# EAGLE design open-lux-D (EAGLE 6.5.0)
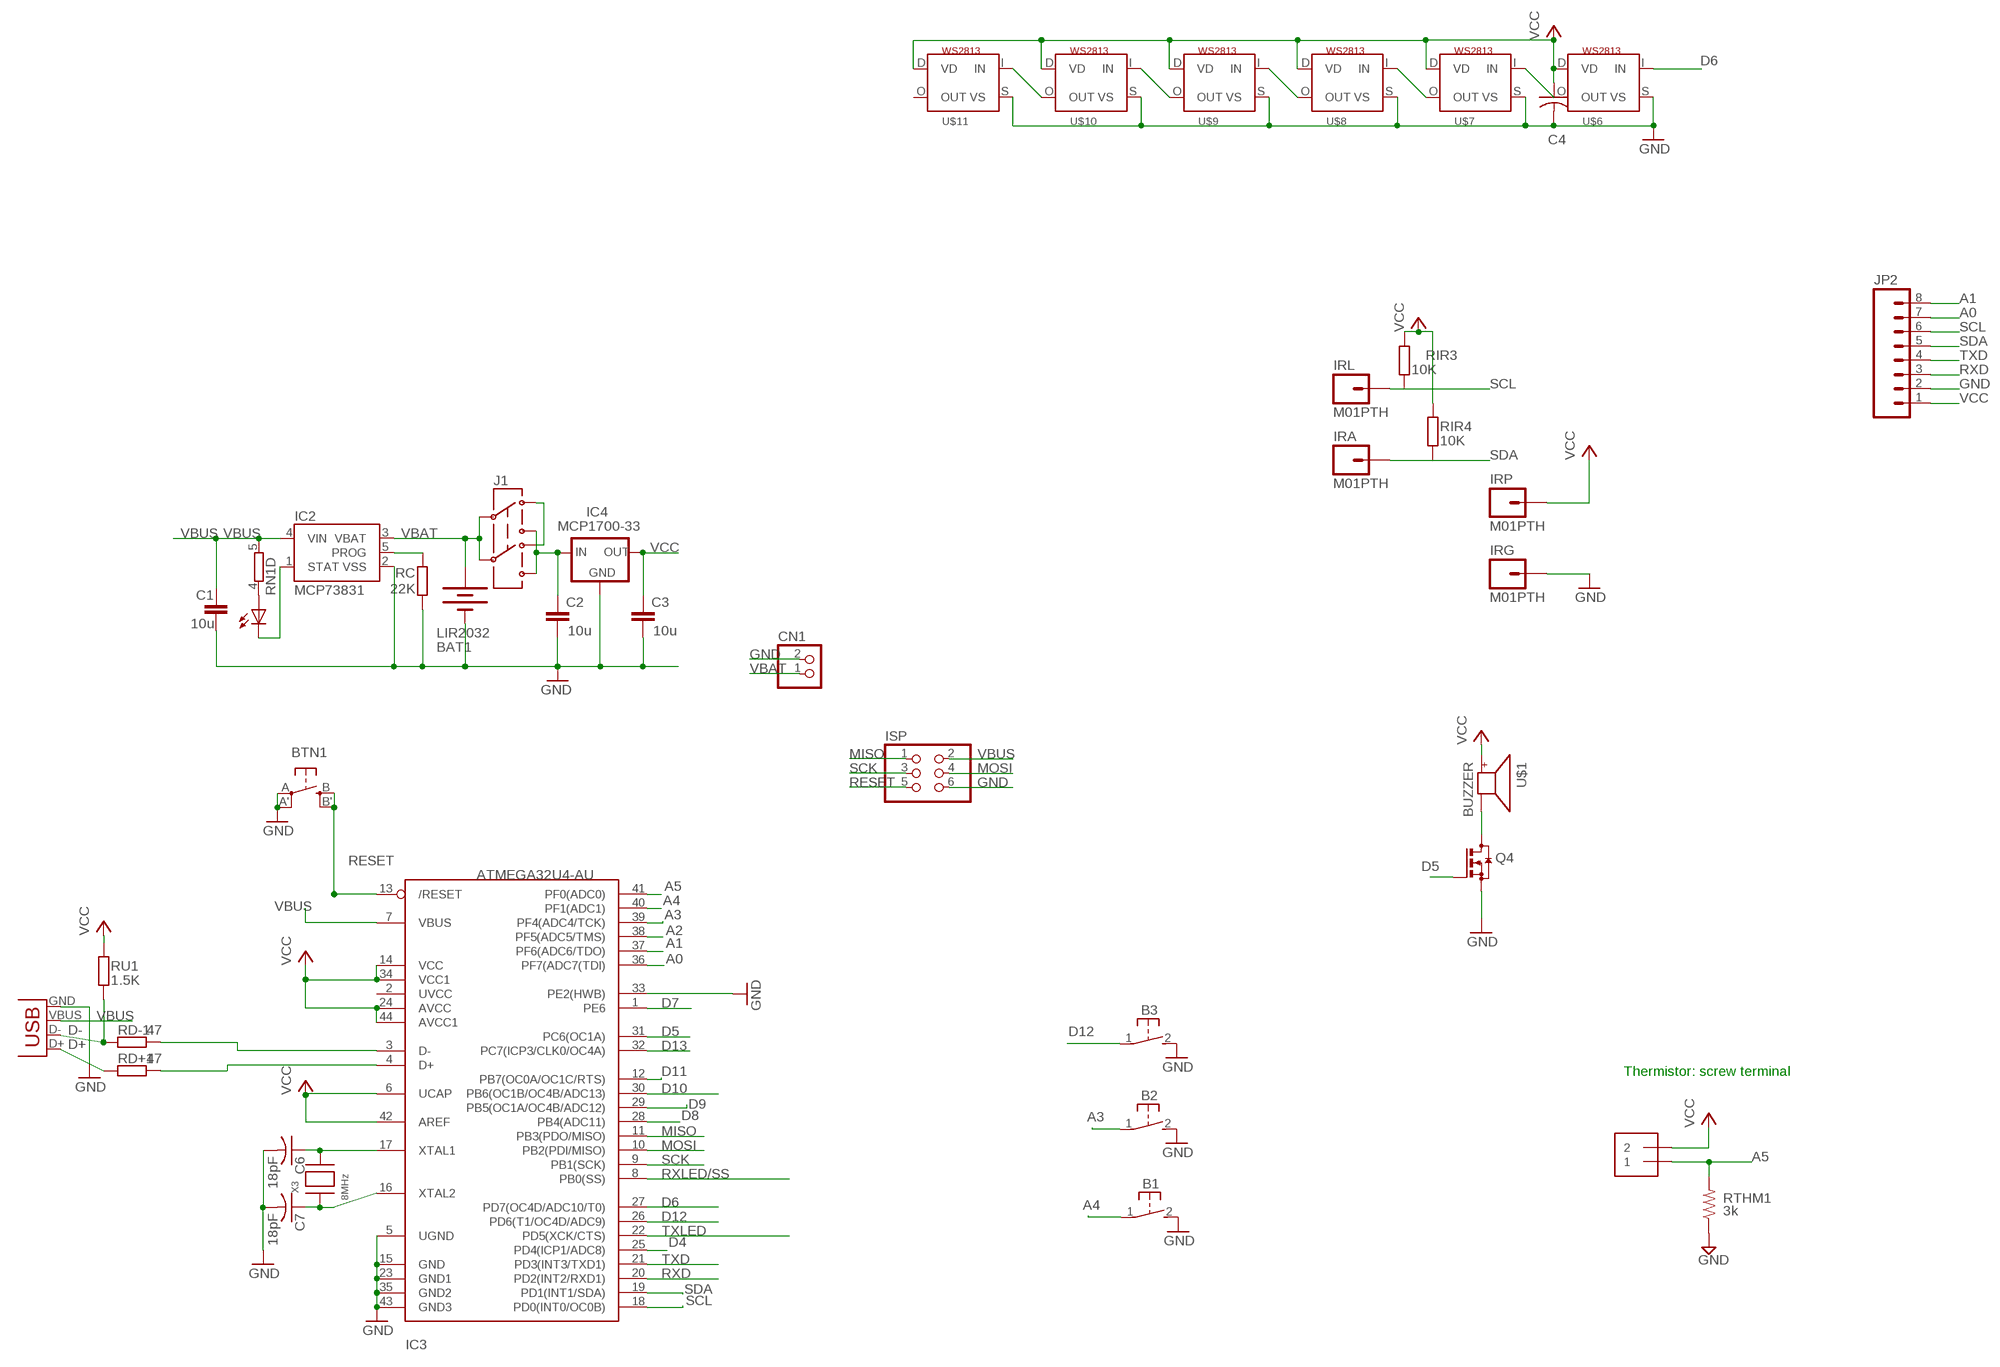
[diagram p0: schematic, sheet 1, part 1 of 2]
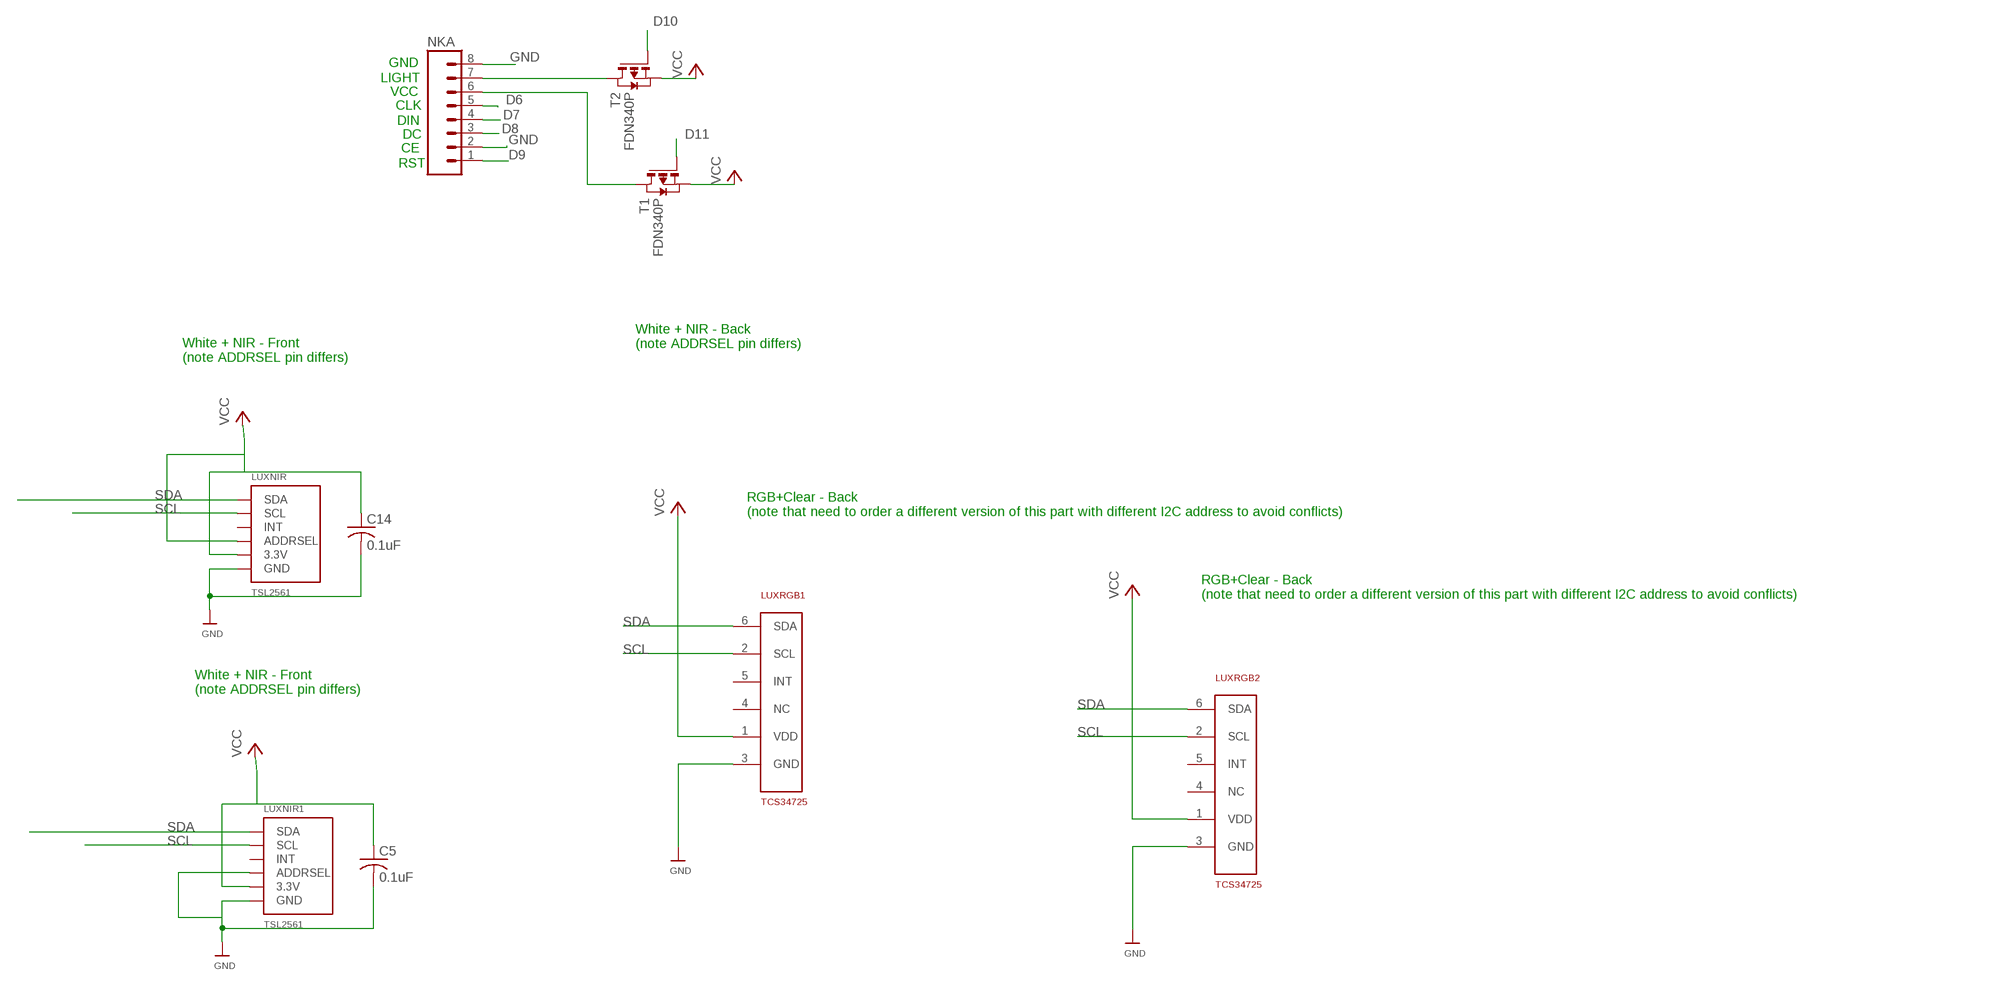
[diagram p1: schematic, sheet 1, part 2 of 2]

## Parts
B1  31-XX  [B3F-31XX]
B2  31-XX  [B3F-31XX]
B3  31-XX  [B3F-31XX]
BAT1  LIR2032  BATTERYBATTCOM_20MM_PTH_SMT  [BATTCOM_20MM_PTH_SMT]
BTN1  EVQQ2  [EVQ-Q2]
C1  10u  C-EUC0805  [C0805]
C2  10u  C-EUC0805  [C0805]
C3  10u  C-EUC0805  [C0805]
C4  C-USC0805K  [C0805K]
C5  0.1uF  C-USC0805  [C0805]
C6  18pF  C-USC0805K  [C0805K]
C7  18pF  C-USC0805K  [C0805K]
C14  0.1uF  C-USC0805  [C0805]
CHG  0805  LEDCHIPLED_0805  [CHIPLED_0805]
CN1  JST_2PIN-SMT-RA  [JST-PH-2-SMT-RA]
IC2  MCP73831  [SOT23-5]
IC3  ATMEGA32U4-AU  [TQFP44]
IC4  MCP1700-33  MCP1700SOT233  [SOT23]
IRA  M01PTH  [1X01]
IRG  M01PTH  [1X01]
IRL  M01PTH  [1X01]
IRP  M01PTH  [1X01]
ISP  PINHD-2X3  [2X03]
J1  AYZ0202  [AYZ0202]
JP2  M08LOCK  [1X08_LOCK]
LUXNIR  TSL2561  [TSL2561_FN@1]
LUXNIR1  TSL2561  [TSL2561_FN@1]
LUXRGB1  TCS34725  [DFN-6]
LUXRGB2  TCS34725  [DFN-6]
NKA  M08LOCK  [1X08_LOCK]
Q4  BSS123  [SOT23]
RC  22K  R-EU_R0805  [R0805]
RD+1  47  R-EU_R0805  [R0805]
RD-1  47  R-EU_R0805  [R0805]
RIR3  10K  R-EU_R0805  [R0805]
RIR4  10K  R-EU_R0805  [R0805]
RN1  4R-NEXB38V  [EXB38V]
RTHM1  3k  R-US_R0805  [R0805@1]
RU1  1.5K  R-EU_R0805  [R0805]
T1  FDN340P  PMOSSOT23  [SOT-23]
T2  FDN340P  PMOSSOT23  [SOT-23]
THM1  1X2-3.5MM  [1X2-3.5MM]
U$1  BUZZER  [SMT-8585-BUZZER]
U$6  WS2813  [RGBLED5050_4]
U$7  WS2813  [RGBLED5050_4]
U$8  WS2813  [RGBLED5050_4]
U$9  WS2813  [RGBLED5050_4]
U$10  WS2813  [RGBLED5050_4]
U$11  WS2813  [RGBLED5050_4]
X2  USBSMD  [USB-MINIB]
X3  8MHz  XTALNX5032  [NX5032]

## Nets
A0: IC3.36(PF7(ADC7(TDI)) JP2.7
A1: IC3.37(PF6(ADC6/TDO)) JP2.8
A2: IC3.38(PF5(ADC5/TMS))
A3: B2.1(P) IC3.39(PF4(ADC4/TCK))
A4: B1.1(P) IC3.40(PF1(ADC1))
A5: IC3.41(PF0(ADC0)) RTHM1.2 THM1.1
D4: IC3.25(PD4(ICP1/ADC8))
D5: IC3.31(PC6(OC1A)) Q4.1(G)
D6: IC3.27(PD7(OC4D/ADC10/T0)) NKA.5 U$6.I(IN)
D7: IC3.1(PE6) NKA.4
D8: IC3.28(PB4(ADC11)) NKA.3
D9: IC3.29(PB5(OC1A/OC4B/ADC12)) NKA.1
D10: IC3.30(PB6(OC1B/OC4B/ADC13)) T2.3(G)
D11: IC3.12(PB7(OC0A/OC1C/RTS)) T1.3(G)
D12: B3.1(P) IC3.26(PD6(T1/OC4D/ADC9))
D13: IC3.32(PC7(ICP3/CLK0/OC4A))
D+: RD+1.1 X2.D+
D-: RD-1.1 RU1.1 X2.D-
GND: B1.2(S) B2.2(S) B3.2(S) BAT1.P$1(-) BTN1.A'(P1) BTN1.A(P) C1.2 C2.2 C3.2 C4.2 C5.2 C6.2 C7.2 C14.2 CN1.2 IC2.2(VSS) IC3.5(UGND) IC3.15(GND) IC3.23(GND1) IC3.33(PE2(HWB)) IC3.35(GND2) IC3.43(GND3) IC4.1(GND) IRG.1 ISP.6 JP2.2 LUXNIR1.ADR(ADDRSEL) LUXNIR1.VSS(GND) LUXNIR.VSS(GND) LUXRGB1.3(GND) LUXRGB2.3(GND) NKA.2 NKA.8 Q4.2(S) RC.1 RTHM1.1 U$6.S(VS) U$7.S(VS) U$8.S(VS) U$9.S(VS) U$10.S(VS) U$11.S(VS) X2.GND
MISO: IC3.11(PB3(PDO/MISO)) ISP.1
MOSI: IC3.10(PB2(PDI/MISO)) ISP.4
N$1: J1.3 J1.6
N$2: C7.1 IC3.16(XTAL2) X3.P$1
N$3: C6.1 IC3.17(XTAL1) X3.P$2
N$4: NKA.7 T2.1(D)
N$5: CHG.C IC2.1(STAT)
N$6: IC2.5(PROG) RC.2
N$7: Q4.3(D) U$1.-
N$8: NKA.6 T1.1(D)
N$10: CHG.A RN1.4
N$21: IC3.4(D+) RD+1.2
N$22: IC3.3(D-) RD-1.2
N$23: U$6.O(OUT) U$7.I(IN)
N$24: U$7.O(OUT) U$8.I(IN)
N$25: U$8.O(OUT) U$9.I(IN)
N$26: U$9.O(OUT) U$10.I(IN)
N$28: U$10.O(OUT) U$11.I(IN)
RESET: BTN1.B'(S1) BTN1.B(S) IC3.13(/RESET) ISP.5
RXD: IC3.20(PD2(INT2/RXD1)) JP2.3
RXLED/SS: IC3.8(PB0(SS))
SCK: IC3.9(PB1(SCK)) ISP.3
SCL: IC3.18(PD0(INT0/OC0B)) IRL.1 JP2.6 LUXNIR1.CLK(SCL) LUXNIR.CLK(SCL) LUXRGB1.2(SCL) LUXRGB2.2(SCL) RIR3.1
SDA: IC3.19(PD1(INT1/SDA)) IRA.1 JP2.5 LUXNIR1.DATA(SDA) LUXNIR.DATA(SDA) LUXRGB1.6(SDA) LUXRGB2.6(SDA) RIR4.1
TXD: IC3.21(PD3(INT3/TXD1)) JP2.4
TXLED: IC3.22(PD5(XCK/CTS))
VBAT: BAT1.P$2(+) CN1.1 IC2.3(VBAT) J1.2 J1.5
VBUS: C1.1 IC2.4(VIN) IC3.7(VBUS) ISP.2 RN1.5 X2.VBUS
VCC: C3.1 C4.1 C5.1 C14.1 IC3.6(UCAP) IC3.14(VCC) IC3.24(AVCC) IC3.34(VCC1) IC3.42(AREF) IC3.44(AVCC1) IC4.2(OUT) IRP.1 JP2.1 LUXNIR1.VDD(3.3V) LUXNIR.ADR(ADDRSEL) LUXNIR.VDD(3.3V) LUXRGB1.1(VDD) LUXRGB2.1(VDD) RIR3.2 RIR4.2 RU1.2 T1.2(S) T2.2(S) THM1.2 U$1.+ U$6.D(VD) U$7.D(VD) U$8.D(VD) U$9.D(VD) U$10.D(VD) U$11.D(VD)
VDD: C2.1 IC4.3(IN) J1.1 J1.4
Unconnected: IC3.2(UVCC) LUXNIR1.INT LUXNIR.INT LUXRGB1.4(NC) LUXRGB1.5(INT) LUXRGB2.4(NC) LUXRGB2.5(INT) RN1.1 RN1.2 RN1.3 RN1.6 RN1.7 RN1.8 U$11.O(OUT)

## Notes on the sheet
- GND
- LIGHT
- VCC
- CLK
- DIN
- DC
- CE
- RST
- White + NIR - Back
  (note ADDRSEL pin differs)
- White + NIR - Front
  (note ADDRSEL pin differs)
- RGB+Clear - Back 
  (note that need to order a different version of this part with different I2C address to avoid conflicts)
- RGB+Clear - Back 
  (note that need to order a different version of this part with different I2C address to avoid conflicts)
- White + NIR - Front
  (note ADDRSEL pin differs)
- Thermistor: screw terminal

## Library data of the parts
B1-B3 = adafruit:31-XX: OMRON SWITCH Now with beefier pads!
BAT1 = SparkFunNew:BATTERY: Battery Holders Various common sizes : AA, AAA, 20mm coin cell and 12mm coin cell.
BTN1 = adafruit:EVQQ2: SMT 6mm switch, EVQQ2 series http://www.ladyada.net/library/eagle
C1-C3 = resistor:C-EU: CAPACITOR, European symbol
C4 = adafruit2013:C-US: CAPACITOR, American symbol
C5-C7 C14 = adafruit:C-US: CAPACITOR, American symbol
CHG = led:LED: LED OSRAM: - CHIPLED LG R971, LG N971, LY N971, LG Q971, LY Q971, LO R971, LY R971 LH N974, LH R974 LS Q976, LO Q976, LY Q976 LO Q996 - Hyper CHIPLED LW Q18S LB Q993, LB Q99A, LB R99A - SideLED LS A670, LO A670, LY A670, LG A670, LP A670 LB A673, LV A673, LT A673, LW A673 LH A674 LY A675 LS A676, LA A676, LO A676, LY A676, LW A676 LS A679, LY A679, LG A679 - Hyper Micro SIDELED® LS Y876, LA Y876, LO Y876, LY Y876 LT Y87S - SmartLED LW L88C, LW L88S LB L89C, LB L89S, LG L890 LS L89K, LO L89K, LY L89K LS L896, LA L896, LO L896, LY L896 - TOPLED LS T670, LO T670, LY T670, LG T670, LP T670 LSG T670, LSP T670, LSY T670, LOP T670, LYG T670 LG T671, LOG T671, LSG T671 LB T673, LV T673, LT T673, LW T673 LH T674 LS T676, LA T676, LO T676, LY T676, LB T676, LH T676, LSB T676, LW T676 LB T67C, LV T67C, LT T67C, LS T67K, LO T67K, LY T67K, LW E67C LS E67B, LA E67B, LO E67B, LY E67B, LB E67C, LV E67C, LT E67C LW T67C LS T679, LY T679, LG T679 LS T770, LO T770, LY T770, LG T770, LP T770 LB T773, LV T773, LT T773, LW T773 LH T774 LS E675, LA E675, LY E675, LS T675 LS T776, LA T776, LO T776, LY T776, LB T776 LHGB T686 LT T68C, LB T68C - Hyper Mini TOPLED® LB M676 - Mini TOPLED Santana® LG M470 LS M47K, LO M47K, LY M47K Source: http://www.osram.convergy.de LUXEON: - LUMILED® LXK2-PW12-R00, LXK2-PW12-S00, LXK2-PW14-U00, LXK2-PW14-V00 LXK2-PM12-R00, LXK2-PM12-S00, LXK2-PM14-U00 LXK2-PE12-Q00, LXK2-PE12-R00, LXK2-PE12-S00, LXK2-PE14-T00, LXK2-PE14-U00 LXK2-PB12-K00, LXK2-PB12-L00, LXK2-PB12-M00, LXK2-PB14-N00, LXK2-PB14-P00, LXK2-PB14-Q00 LXK2-PR12-L00, LXK2-PR12-M00, LXK2-PR14-Q00, LXK2-PR14-R00 LXK2-PD12-Q00, LXK2-PD12-R00, LXK2-PD12-S00 LXK2-PH12-R00, LXK2-PH12-S00 LXK2-PL12-P00, LXK2-PL12-Q00, LXK2-PL12-R00 Source: www.luxeon.com KINGBRIGHT: KA-3528ASYC Source: www.kingbright.com
CN1 = adafruit:JST_2PIN: JST 2-Pin Connectors of various flavors SMT-RA (S2B-PH-SM4) 4UConnector #17311 SMT (B2B-PH-SM4) THM-RA (S2B-PH) THM (B2B-PH)
IC2 = SparkFunNew:MCP73831: Microchip's MCP73831 Miniature single cell, fully integrated Li-Ion, Li-polymer charge management controller http://ww1.microchip.com/downloads/en/DeviceDoc/21984a.pdf
IC3 = adaprog:ATMEGA32U4
IC4 = adafruit:MCP1700: VOLTAGE REGULATOR
IRA IRG IRL IRP = SparkFun-Connectors:M01: Header 1 Standard 1-pin 0.1" header. Use with straight break away headers (SKU : PRT-00116), right angle break away headers (PRT-00553), swiss pins (PRT-00743), machine pins (PRT-00117), and female headers (PRT-00115).
ISP = pinhead:PINHD-2X3: PIN HEADER
J1 = SparkFunNew:AYZ0202: SPDT Slide Switch Simple SMD single-pull double-throw slide switch. Good for less than 350mA power switch, switching UARTs between devices, etc. Spark Fun Electronics SKU : COM-00597
JP2 NKA = SparkFun-Connectors:M08: Header 8 Standard 8-pin 0.1" header. Use with straight break away headers (SKU : PRT-00116), right angle break away headers (PRT-00553), swiss pins (PRT-00743), machine pins (PRT-00117), and female headers (PRT-00115).
LUXNIR LUXNIR1 = microbuilder:TSL2561: TSL2561 Light-To-Digital Sensor Mouser Part Numbers: CS (obsolete): 856-TSL2561CS DFN (cheapest): 856-TSL2561FN
LUXRGB1 LUXRGB2 = dwbLibrary:TCS34725
Q4 = transistor-small-signal:BSS123: N-CHANNEL MOS FET
RC RD+1 RD-1 RIR3 RIR4 RU1 = rcl:R-EU_: RESISTOR, European symbol
RN1 = resistor-dil:4R-N: Array Chip Resistor Source: RS Component / Phycomp; OC_FARNELL: unknown; OC_NEWARK: unknown
RTHM1 = rcl:R-US_: RESISTOR, American symbol
T1 T2 = zetex:PMOSSOT23: MOS FET
THM1 = adafruit:1X2: 3.5mm Terminal block http://www.ladyada.net/library/pcb/eaglelibrary.html
U$1 = adafruit:BUZZER
U$6-U$11 = adafruit:WS2813
X2 = SparkFun:USB: USB Connectors USB-B-PTH is fully proven SKU : PRT-00139 USB-miniB is fully proven SKU : PRT-00587 USB-A-PCB is untested. USB-A-H is throughly reviewed, but untested. Spark Fun Electronics SKU : PRT-00437 USB-B-SMT is throughly reviewed, but untested. Needs silkscreen touching up. USB-A-S has not been used/tested USB-MB-H has not been used/tested
X3 = adaprog:XTAL

## Net classes
0 default: width 0.203 mm, clearance 0.203 mm
1 power: width 0.254 mm, clearance 0.203 mm

## Board
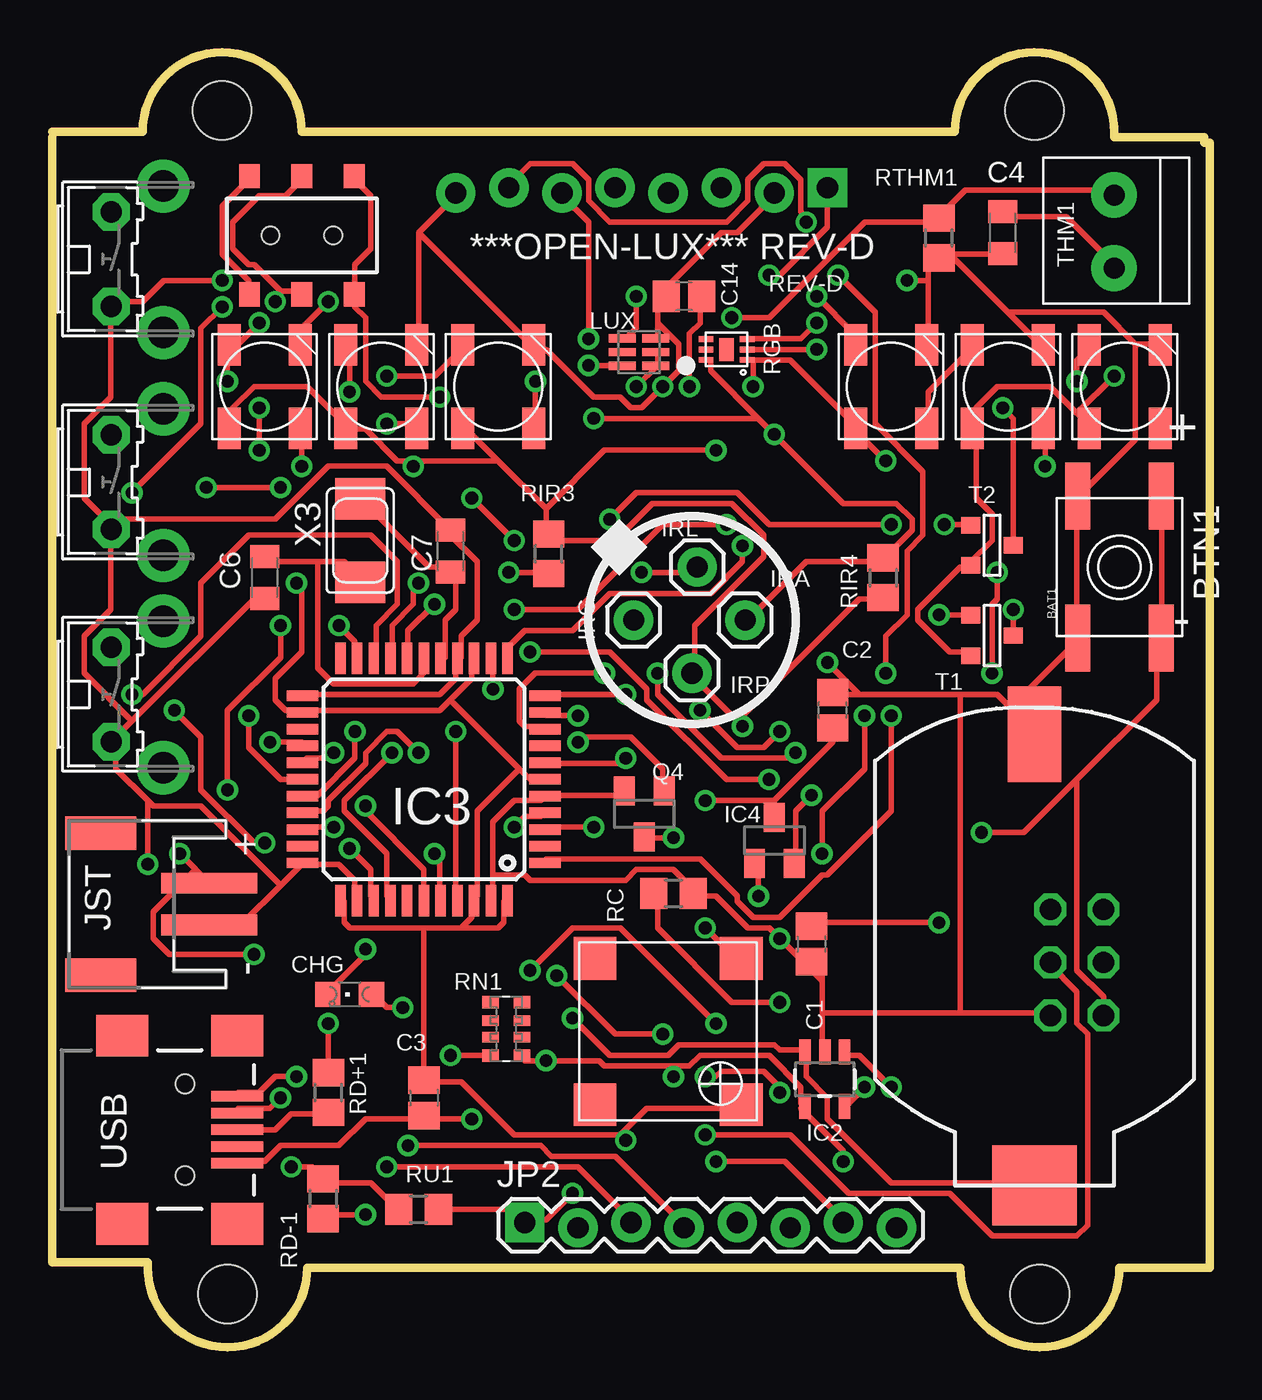
[diagram p2: board, top side]
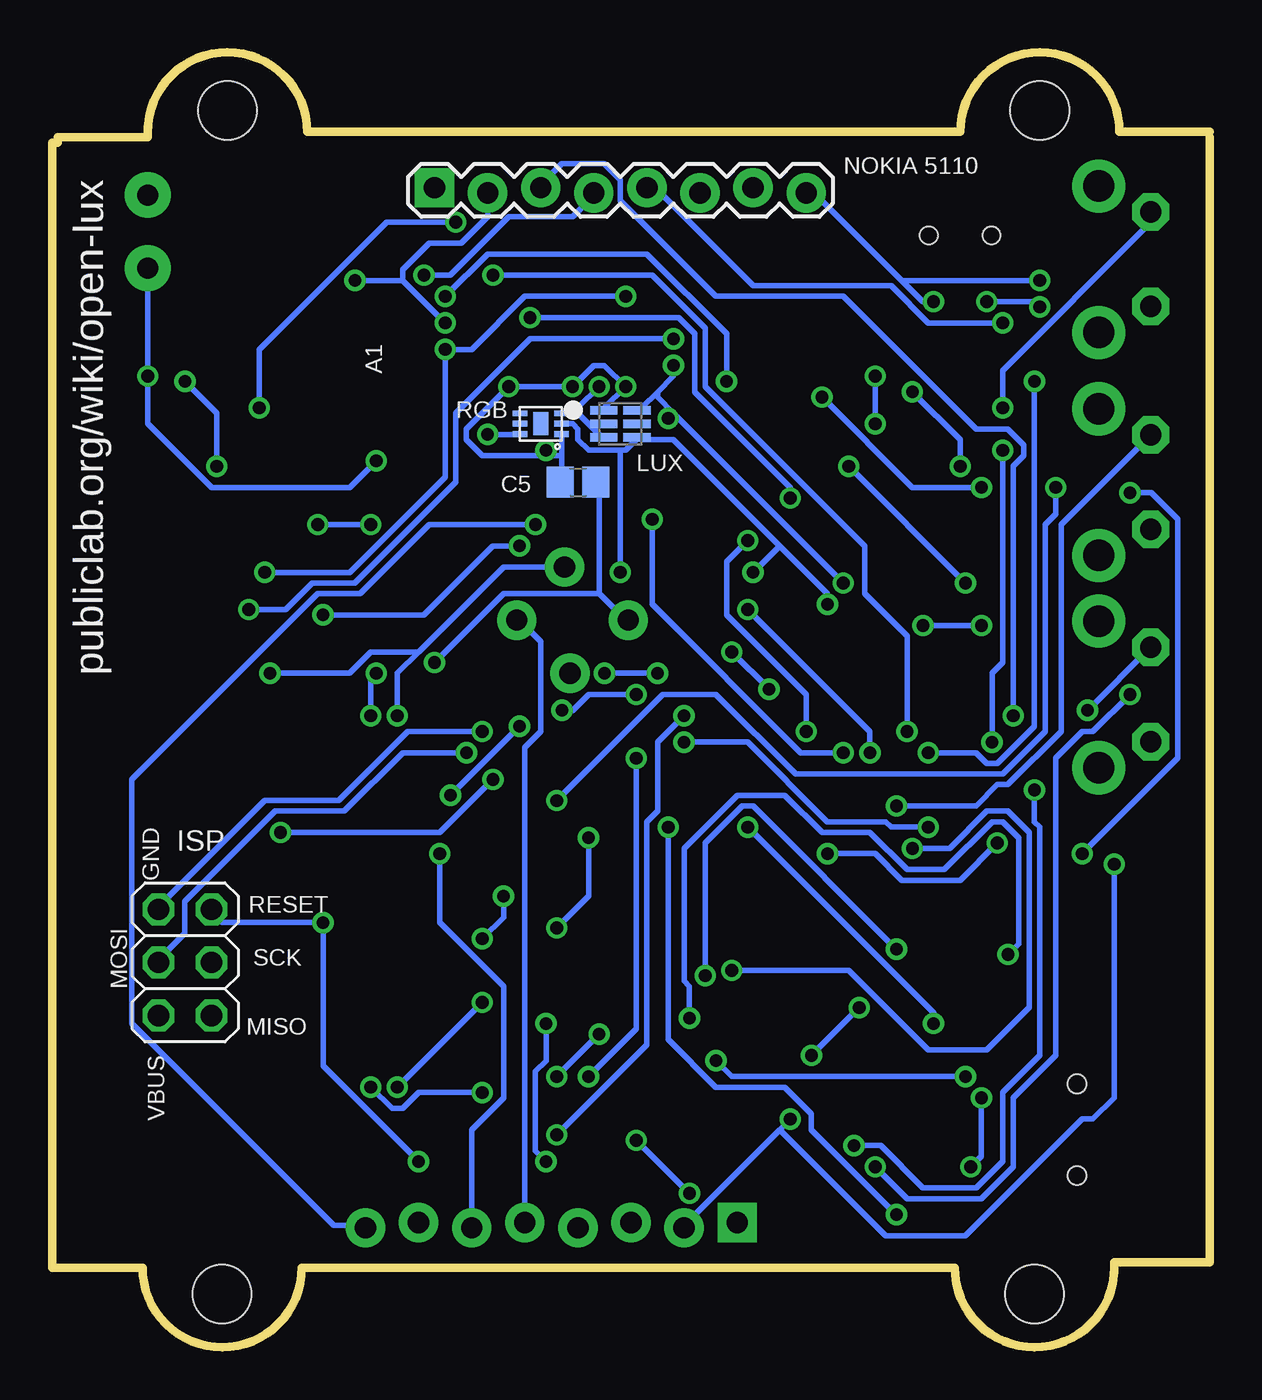
[diagram p3: board, bottom side, seen from below]

Size 55.37 x 61.98 mm. Coordinates in mm from the lower left corner, seen from the top.
Outline: 55.12,57.66 55.37,57.66 55.37,3.81 51.05,3.81 arc-180 43.43,3.81 12.19,3.81 arc-180 4.57,3.81
Outline: 4.57,3.81 4.57,3.56
Outline: 4.57,3.81 4.57,4.06 0,4.06 0,57.91
Outline: 50.8,58.17 50.8,58.42
Outline: 50.8,58.17 arc180 43.18,58.17 11.94,58.17 arc180 4.32,58.17 0,58.17
Outline: 55.12,57.91 50.8,57.91 50.8,58.17
Copper layers (1*16): Top 0.035mm / dielectric 1.5mm / Bottom 0.035mm
Design rules "default": minimum track width 10mil, minimum drill 24mil, track to track 8mil, track to pad 8mil, pad to pad 8mil, via to via 8mil, smd to smd 8mil, copper to edge 40mil, drill to drill 8mil, minimum pad ring 10mil, minimum via ring 8mil, stop-mask expansion 4mil, vias tented up to drill 0mil, thermal gap 10mil
Holes 2.8 mm at 8.38,2.54 47.24,2.54 46.99,59.18 8.13,59.18

### Footprints (pad centres in the part's own frame; a part is rotated, then mirrored left to right if it is on the bottom)
B3F-31XX = drill 1.016 pad 1.778 octagon: 1 -2.261,-1.245; 2 2.261,-1.245 | drill 1.499 pad 2.54: 3 -3.505,1.245; 4 3.505,1.245
BATTCOM_20MM_PTH_SMT = smd 4.572 x 2.54: P$1 0,0 | smd 3.81 x 4.064: P$2 21.59,0
EVQ-Q2 = smd 3.2 x 1.2: A -3.4,-2; A' 3.4,-2; B -3.4,2; B' 3.4,2
C0805 = smd 1.3 x 1.5: 1 -0.85,0; 2 0.85,0
C0805K = smd 1.1 x 1.4: 1 -1,0; 2 1,0
CHIPLED_0805 = smd 1.2 x 1.2: A 0,-1.05; C 0,1.05
JST-PH-2-SMT-RA = smd 1 x 4.6: 1 1,-3.7; 2 -1,-3.7 | smd 1.6 x 3.4: NC1 -3.4,1.5; NC2 3.4,1.5
SOT23-5 = smd 0.55 x 1.2: 1 -0.95,-1.3; 2 0,-1.3; 3 0.95,-1.3; 4 0.95,1.3; 5 -0.95,1.3
TQFP44 = smd 1.5 x 0.5: 1 -5.8,4; 2 -5.8,3.2; 3 -5.8,2.4; 4 -5.8,1.6; 5 -5.8,0.8; 6 -5.8,0; 7 -5.8,-0.8; 8 -5.8,-1.6; 9 -5.8,-2.4; 10 -5.8,-3.2; 11 -5.8,-4; 23 5.8,-4; 24 5.8,-3.2; 25 5.8,-2.4; 26 5.8,-1.6; 27 5.8,-0.8; 28 5.8,0; 29 5.8,0.8; 30 5.8,1.6; 31 5.8,2.4; 32 5.8,3.2; 33 5.8,4 | smd 0.5 x 1.5: 12 -4,-5.8; 13 -3.2,-5.8; 14 -2.4,-5.8; 15 -1.6,-5.8; 16 -0.8,-5.8; 17 0,-5.8; 18 0.8,-5.8; 19 1.6,-5.8; 20 2.4,-5.8; 21 3.2,-5.8; 22 4,-5.8; 34 4,5.8; 35 3.2,5.8; 36 2.4,5.8; 37 1.6,5.8; 38 0.8,5.8; 39 0,5.8; 40 -0.8,5.8; 41 -1.6,5.8; 42 -2.4,5.8; 43 -3.2,5.8; 44 -4,5.8
SOT23 = smd 1 x 1.4: 1 -0.95,-1.1; 2 0.95,-1.1; 3 0,1.1
1X01 = drill 1.016 pad 1.88: 1 0,0
2X03 = drill 1.016 octagon: 1 -2.54,-1.27; 2 -2.54,1.27; 3 0,-1.27; 4 0,1.27; 5 2.54,-1.27; 6 2.54,1.27
AYZ0202 = smd 1 x 1.15: 1 -2.5,2.825; 2 0,2.825; 3 2.5,2.825; 4 -2.5,-2.825; 5 0,-2.825; 6 2.5,-2.825 | hole 0.85: 1.5,0; -1.5,0
1X08_LOCK = drill 1.016 pad 1.88 square: 1 0,0.127 | drill 1.016 pad 1.88: 2 2.54,-0.127; 3 5.08,0.127; 4 7.62,-0.127; 5 10.16,0.127; 6 12.7,-0.127; 7 15.24,0.127; 8 17.78,-0.127
TSL2561_FN@1 = smd 1.3 x 0.4: ADR -0.8,0; CLK 0.8,-0.65; DATA 0.8,0.65; INT 0.8,0; VDD -0.8,0.65; VSS -0.8,-0.65
DFN-6 = smd 0.28 x 0.7: 1 -0.5,-0.988; 2 0,-0.988; 3 0.5,-0.988; 4 0.5,0.988; 5 0,0.988; 6 -0.5,0.988 | smd 1.1 x 0.7: P$1 0,0
R0805 = smd 1.3 x 1.5: 1 -0.95,0; 2 0.95,0
EXB38V = smd 0.6 x 0.8: 1 -1.275,-0.75; 4 1.275,-0.75; 5 1.275,0.75; 8 -1.275,0.75 | smd 0.5 x 0.8: 2 -0.4,-0.75; 3 0.4,-0.75; 6 0.4,0.75; 7 -0.4,0.75
R0805@1 = smd 1.3 x 1.5: 1 -0.95,0; 2 0.95,0
SOT-23 = smd 0.787 x 0.889: 1 0.025,-1.016; 2 -0.94,1.016; 3 0.991,1.016
1X2-3.5MM = drill 1 pad 2.184: 1 1.8,0; 2 -1.7,0
SMT-8585-BUZZER = smd 2.05 x 2.05: + -3.5,-3.5; - 3.5,-3.5; NC1 -3.5,3.5; NC2 3.5,3.5
RGBLED5050_4 = smd 2 x 1.1: D -2,1.7; I 2,1.7; O -2,-1.7; S 2,-1.7
USB-MINIB = smd 2.5 x 0.5: D+ 2.5,0; D- 2.5,0.8; GND 2.5,-1.6; ID 2.5,-0.8; VBUS 2.5,1.6 | smd 2.5 x 2: GND@1 -3,-4.5; GND@2 -3,4.5; GND@3 2.5,4.5; GND@4 2.5,-4.5 | hole 0.9: 0,2.2; 0,-2.2
NX5032 = smd 2 x 2.4: P$1 2,0; P$2 -2,0

### Placement (x,y rotation side)
B1  4.06,31.24 270 top
B2  4.06,41.4 270 top
B3  4.06,52.07 270 top
BAT1  46.99,29.34 270 top
BTN1  51.05,37.34 270 top
C1  36.32,19.3 270 top
C2  37.34,30.48 90 top
C3  17.78,11.94 270 top
C4  45.47,53.34 270 top
C5  30.23,41.4 0 bottom
C6  10.16,36.83 270 top
C7  19.05,38.1 90 top
C14  30.23,50.29 180 top
CHG  14.22,16.89 90 top
CN1  3.81,21.21 90 top
IC2  36.96,12.83 180 top
IC3  17.78,27.18 180 top
IC4  34.54,24.26 0 top
IRA  33.15,34.8 0 top
IRG  27.81,34.8 0 top
IRL  30.86,37.34 0 top
IRP  30.61,32.26 0 top
ISP  49.02,18.42 270 bottom
J1  11.94,53.21 180 top
JP2  22.61,5.84 0 top
LUXNIR  28.07,47.62 180 top
LUXNIR1  28.19,44.2 0 bottom
LUXRGB1  32.26,47.75 90 top
LUXRGB2  32,44.2 90 bottom
NKA  37.08,55.37 0 bottom
Q4  28.32,25.53 180 top
RC  29.72,21.72 180 top
RD+1  13.21,12.19 90 top
RD-1  12.95,7.11 270 top
RIR3  23.75,37.97 90 top
RIR4  39.75,36.83 270 top
RN1  21.72,15.24 270 top
RTHM1  42.42,53.09 90 top
RU1  17.53,6.6 0 top
T1  44.96,34.04 90 top
T2  44.96,38.35 90 top
THM1  50.8,53.34 90 top
U$1  29.46,15.11 90 top
U$6  10.16,45.97 90 top
U$7  15.75,45.97 90 top
U$8  21.34,45.97 90 top
U$9  40.13,45.97 90 top
U$10  45.72,45.97 90 top
U$11  51.31,45.97 90 top
X2  6.35,10.41 0 top
X3  14.73,38.61 90 top

### Tracks (layer width: path | path; a pad name or v marks a point on that pad's centre or on a via)
A0  (via drill 0.61)
  Top 0.254: v14.22,23.88 15.24,22.86 15.24,21.59 IC3.36 | v22.86,18.03 24.89,20.07 27.18,20.07 v31.75,15.49 | v31.75,8.89 35.05,8.89 37.85,6.1 JP2.7
  Bottom 0.254: v14.22,23.88 12.45,23.88 10.67,25.65 9.65,25.65 8.64,24.64 8.64,16.26 10.67,14.22 13.46,14.22 17.27,18.03 v22.86,18.03 | v31.75,15.49 31.75,13.72 32.26,13.21 32.26,9.4 v31.75,8.89
A1  (via drill 0.61)
  Top 0.254: v16.26,28.45 13.97,26.16 13.97,25.65 16,23.62 16,21.59 IC3.37 | v22.1,35.31 25.15,35.31 29.21,39.37 v32.26,39.37
  Bottom 0.254: v16.26,28.45 16.26,29.46 v22.1,35.31 | v32.26,39.37 37.34,39.37 40.64,36.07 42.67,36.07 51.56,27.18 51.56,15.49 41.91,5.84 40.39,5.84 JP2.8
A3  (via drill 0.61)
  Top 0.254: IC3.39 17.78,22.86 14.99,25.65 v14.99,25.91
  Bottom 0.254: v14.99,25.91 11.18,25.91 10.16,26.92 9.65,26.92 7.11,29.46 7.11,39.37 B2.1
A4  (via drill 0.61)
  Top 0.254: v18.29,23.62 18.54,23.37 18.54,21.59 IC3.40 | v10.16,24.13 9.65,24.13 7.11,26.67 7.11,29.21 v5.84,30.48
  Bottom 0.254: v18.29,23.62 16,23.62 14.73,22.35 11.94,22.35 v10.16,24.13 | B1.1 v5.84,30.48
A5  (via drill 0.61)
  Top 0.254: v19.3,29.46 19.3,21.59 IC3.41 | v20.07,40.64 v22.1,38.61 | v32.51,49.28 34.29,49.28 38.86,53.85 42.42,53.85 RTHM1.2 42.42,54.1 43.69,55.37 50.8,55.37 THM1.1
  Bottom 0.254: v19.3,29.46 19.3,31.24 23.11,35.05 23.11,37.59 v22.1,38.61 | v20.07,40.64 20.07,41.15 24.64,45.72 24.64,48.51 25.4,49.28 v32.51,49.28
D5  (via drill 0.61)
  Top 0.254: v25.15,28.96 25.4,29.21 27.69,29.21 29.21,27.69 29.21,26.67 Q4.1 | v13.46,24.89 12.19,24.89 IC3.31
  Bottom 0.254: v25.15,28.96 22.1,28.96 18.29,25.15 15.49,25.15 15.24,24.89 v13.46,24.89
D6  (via drill 0.61)
  Top 0.254: v13.46,28.45 13.21,28.19 12.19,28.19 IC3.27 | v8.38,46.23 8.38,47.75 U$6.I 8.64,47.75 v9.91,49.02
  Bottom 0.254: v13.46,28.45 11.18,28.45 10.67,27.94 10.16,27.94 8.38,29.72 v8.38,46.23 | v9.91,49.02 13.46,49.02 15.24,50.8 21.84,50.8 26.42,55.37 26.92,55.37 NKA.5
D7  (via drill 0.61)
  Top 0.254: v40.13,30.23 40.13,25.65 37.08,22.61 36.83,22.61 34.8,20.57 33.53,20.57 32.77,21.34 32.77,21.59 30.99,23.37 23.62,23.37 IC3.1 | v39.88,32.26 39.88,34.04 40.89,35.05 40.89,38.1 41.66,38.86 41.66,41.91 39.37,44.2 39.37,49.53 v37.59,51.31
  Bottom 0.254: v40.13,30.23 40.13,32 v39.88,32.26 | v37.59,51.31 36.32,51.31 33.53,54.1 30.48,54.1 29.46,55.12 NKA.4
D8  (via drill 0.61)
  Top 0.254: IC3.28 10.92,27.18 9.4,28.7 v9.4,30.23
  Bottom 0.254: v9.4,30.23 9.4,42.16 8.89,42.67 8.89,43.18 9.65,43.94 11.18,43.94 17.53,50.29 23.62,50.29 28.19,54.86 28.19,55.88 28.96,56.64 30.99,56.64 32,55.63 NKA.3
D9  (via drill 0.61)
  Top 0.254: v14.48,29.46 14.48,28.19 12.7,26.42 12.19,26.42 IC3.29 | v34.29,51.31 34.8,51.31 37.08,53.59 NKA.1
  Bottom 0.254: v14.48,29.46 14.48,34.04 16.51,36.07 16.51,38.35 24.13,45.97 24.13,48.77 26.67,51.31 v34.29,51.31
D10  (via drill 0.61)
  Top 0.254: v42.67,39.37 43.94,39.37 T2.3 | v40.13,39.37 34.29,39.37 32.77,40.89 27.94,40.89 v26.67,39.62 | v17.53,28.45 16.51,29.46 16,29.46 14.99,28.45 14.99,27.94 13.21,26.16 13.21,25.91 12.95,25.65 12.19,25.65 IC3.30
  Bottom 0.254: v40.13,39.37 v42.67,39.37 | v26.67,39.62 26.67,35.56 19.56,28.45 v17.53,28.45
D11  (via drill 0.61)
  Top 0.254: v42.42,35.05 43.94,35.05 T1.3 | v33.02,38.35 33.02,37.59 31.5,36.07 26.67,36.07 24.89,34.29 22.61,34.29 21.84,33.53 21.84,33.02 IC3.12
  Bottom 0.254: v42.42,35.05 37.59,35.05 34.29,38.35 v33.02,38.35
D12  (via drill 0.61)
  Top 0.254: v10.41,28.96 11.94,28.96 IC3.26 | v9.91,44.96 v9.91,42.93
  Bottom 0.254: v10.41,28.96 10.41,32.26 9.91,32.77 v9.91,42.93 | v9.91,44.96 9.91,46.74 3.05,53.59 3.05,54.1 B3.1
D+
  Top 0.254: X2.D+ 10.67,10.41 11.43,11.18 13.21,11.18 RD+1.1
D-  (via drill 0.61)
  Top 0.254: RU1.1 16.51,6.6 15.24,7.87 12.95,7.87 RD-1.1 12.95,8.13 12.45,8.64 v11.43,8.64 | v10.92,11.94 10.41,11.43 8.89,11.43 X2.D-
  Bottom 0.254: v10.92,11.94 10.92,9.14 v11.43,8.64
GND  (via drill 0.61)
  Top 0.254: 17.78,10.92 14.99,10.92 13.72,9.65 10.92,9.65 10.16,8.89 8.89,8.89 X2.GND | 17.78,10.92 v20.07,10.92 | 17.78,10.92 C3.2 | IC3.23 12.19,31.24 18.54,31.24 19.3,32 19.3,32.77 IC3.15 19.56,33.02 19.56,34.04 20.32,34.8 20.32,37.59 19.05,38.86 C7.2 19.05,39.12 16,42.16 13.21,42.16 10.67,39.62 2.54,39.62 | IC3.35 14.48,21.59 14.48,22.35 13.72,23.11 12.19,23.11 IC3.33 11.94,23.11 10.92,22.1 | 10.92,22.1 9.14,20.32 7.62,20.32 CN1.2 | 3.81,29.97 B1.2 3.05,28.96 3.05,27.69 4.57,26.16 | 3.81,29.97 9.65,35.81 10.16,35.81 C6.2 | 3.81,29.97 1.52,32.26 1.52,34.04 2.79,35.31 2.79,39.12 B2.2 | 2.54,39.62 2.79,39.37 B2.2 | 2.54,39.62 1.52,40.64 1.52,44.2 2.79,45.47 2.79,49.78 B3.2 3.05,50.04 4.32,50.04 5.33,51.05 v8.13,51.05 | 10.92,22.1 7.11,25.91 4.83,25.91 4.57,26.16 | 2.54,39.62 B2.2 | 4.57,26.16 v4.57,23.11 | Q4.2 27.18,26.42 23.62,26.42 IC3.5 23.37,26.16 22.1,26.16 21.08,25.15 21.08,22.61 | 21.08,22.61 21.08,21.59 IC3.43 | 36.83,17.53 36.83,17.78 36.32,18.29 C1.2 | 36.83,17.53 36.83,16 | 36.83,16 36.83,14.22 IC2.2 | v33.78,21.59 33.78,23.11 IC4.1 | 36.83,17.53 v34.8,19.56 34.29,20.07 33.27,20.07 31.75,21.59 30.73,21.59 RC.1 30.73,21.84 29.72,22.86 27.94,22.86 27.43,22.35 22.86,22.35 22.61,22.61 21.08,22.61 | 36.83,16 43.43,16 | 43.43,16 47.75,16 ISP.6 | v13.21,50.04 11.94,48.77 11.94,48.01 U$6.S | 17.53,53.34 17.53,48.01 U$7.S | 17.53,53.34 19.3,55.12 NKA.8 | 17.53,53.34 22.86,48.01 U$8.S 23.11,47.75 23.62,47.75 25.91,45.47 27.18,45.47 27.69,44.96 28.19,44.96 v29.21,45.97 29.97,46.74 29.97,48.01 28.96,49.02 | 28.96,49.02 28.96,50.04 29.21,50.29 C14.2 29.46,50.29 29.46,50.8 32,53.34 32.77,53.34 34.54,55.12 NKA.2
  Top 0.254: 28.96,49.02 28.96,48.26 LUXNIR.VSS | v36.58,49.02 35.81,48.26 33.27,48.26 LUXRGB1.3 | 42.93,52.32 42.42,52.32 RTHM1.1 | 42.93,52.32 45.47,52.32 C4.2 | 41.91,51.05 41.91,51.56 42.42,52.07 RTHM1.1 | 41.91,51.05 41.91,48.01 U$9.S | 42.93,52.32 45.72,49.53 | 45.72,49.53 47.24,48.01 U$10.S | 42.93,52.32 RTHM1.1 | 51.82,48.01 52.83,48.01 U$11.S | 51.82,48.01 50.29,49.53 45.72,49.53 | 43.43,31.24 45.21,31.24 45.72,30.73 | 43.43,31.24 38.61,31.24 | 38.61,31.24 37.34,31.24 C2.2 | 45.72,30.73 46.99,29.46 BAT1.P$1 | 38.61,31.24 v37.08,32.77 | 45.72,30.73 45.97,30.73 49.02,33.78 BTN1.A' 49.02,34.04 49.02,40.64 BTN1.A 49.28,40.89 51.82,43.43 51.82,48.01 | 41.91,51.05 v40.89,51.05 | 43.43,31.24 43.43,16
  Bottom 0.254: v20.07,10.92 20.57,10.41 | 20.57,10.41 25.15,5.84 JP2.2 | 20.57,10.41 15.49,5.33 11.68,5.33 6.1,10.92 5.59,10.92 4.57,11.94 v4.57,23.11 | v33.78,21.59 33.78,20.57 v34.8,19.56 | v13.21,50.04 13.72,50.04 14.73,51.05 | 14.73,51.05 18.8,55.12 19.3,55.12 NKA.8 | 30.23,44.7 30.99,44.7 LUXRGB2.3 | 29.46,43.94 29.21,43.69 LUXNIR1.VSS | 29.46,43.94 30.23,44.7 | 29.46,43.94 29.21,44.2 LUXNIR1.ADR | 30.23,44.7 30.23,44.96 v29.21,45.97 | 38.61,51.05 v36.58,49.02 | 38.61,51.05 38.61,51.56 37.34,52.83 35.81,52.83 34.54,54.1 NKA.2 | 29.21,36.07 29.21,41.4 C5.2 | 29.21,36.07 27.94,34.8 IRG.1 | 29.21,36.07 33.78,36.07 v37.08,32.77 | v40.89,51.05 38.61,51.05 | 14.73,51.05 v8.13,51.05
MISO  (via drill 0.61)
  Top 0.254: v27.43,31.24 23.62,31.24 IC3.11 | v30.99,30.48 32.77,28.7 34.04,28.7 v34.8,29.46
  Bottom 0.254: v27.43,31.24 29.72,31.24 30.48,30.48 v30.99,30.48 | v34.8,29.46 38.35,29.46 41.66,26.16 45.21,26.16 50.29,21.08 ISP.1
MOSI  (via drill 0.61)
  Top 0.254: v25.15,30.23 23.62,30.23 IC3.10 | v31.24,10.16 35.31,10.16 38.1,7.37 42.93,7.37 44.96,5.33 49.02,5.33 49.53,5.84 49.53,14.99 49.02,15.49 49.02,17.02 47.75,18.29 ISP.4
  Bottom 0.254: v25.15,30.23 26.42,28.96 26.42,25.65 26.92,25.15 26.92,14.48 v31.24,10.16
N$1
  Top 0.254: J1.3 9.4,50.55 9.4,51.05 8.13,52.32 8.13,54.61 9.4,55.88 J1.6
N$2
  Top 0.254: X3.P$1 14.73,40.64 18.03,37.34 19.05,37.34 C7.1 19.05,37.08 19.3,36.83 19.3,35.31 18.8,34.8 18.8,33.02 IC3.16
N$3
  Top 0.254: 12.7,37.59 13.97,37.59 14.73,36.83 X3.P$2 | 12.7,37.59 10.16,37.59 C6.1 | IC3.17 17.78,32.26 17.27,31.75 13.46,31.75 12.7,32.51 12.7,37.59
N$4  (via drill 0.61)
  Top 0.254: T2.1 45.97,44.45 v45.47,44.96 | v36.07,53.85 36.07,54.1 35.81,54.36 35.81,55.88 35.05,56.64 34.04,56.64 33.27,55.88 33.27,54.86 32.26,53.85 26.67,53.85 25.65,54.86 25.65,55.88 24.89,56.64 22.86,56.64 21.84,55.63 NKA.7
  Bottom 0.254: v45.47,44.96 45.47,47.75 39.37,53.85 v36.07,53.85
N$5  (via drill 0.61)
  Top 0.254: v14.99,19.05 14.99,18.8 13.21,17.02 CHG.C | v24.13,17.78 26.92,14.99 v29.21,14.99 | v31.24,12.95 31.75,12.95 32,13.21 34.04,13.21 34.8,12.45 v34.8,12.19 | v40.13,12.45 38.61,13.97 38.1,13.97 IC2.1
  Bottom 0.254: v14.99,19.05 21.84,25.91 22.35,25.91 24.13,24.13 v24.13,17.78 | v31.24,12.95 v29.21,14.99 | v34.8,12.19 37.85,12.19 38.61,11.43 39.12,11.43 v40.13,12.45
N$6  (via drill 0.61)
  Top 0.254: v38.86,12.45 38.1,11.68 IC2.5 | v34.8,16.51 32.51,16.51 28.96,20.07 28.96,21.59 RC.2
  Bottom 0.254: v34.8,16.51 v38.86,12.45
N$7  (via drill 0.61)
  Top 0.254: v29.72,24.38 28.45,24.38 Q4.3 | v31.24,20.07 32.77,18.54 U$1.-
  Bottom 0.254: v29.72,24.38 29.72,21.59 v31.24,20.07
N$8  (via drill 0.61)
  Top 0.254: v45.97,35.31 T1.1 | v25.65,48.26 25.65,53.85 24.38,55.12 NKA.6
  Bottom 0.254: v45.97,35.31 44.2,35.31 42.93,36.58 40.89,36.58 36.07,41.4 36.07,44.7 32.51,48.26 v25.65,48.26
N$10  (via drill 0.61)
  Top 0.254: v19.05,13.97 20.83,13.97 RN1.4 | v16.76,16.26 16,16.26 15.49,16.76 CHG.A
  Bottom 0.254: v16.76,16.26 v19.05,13.97
N$21  (via drill 0.61)
  Top 0.254: v13.21,15.49 RD+1.2 | v22.1,24.89 22.61,25.4 23.37,25.4 IC3.4
  Bottom 0.254: v13.21,15.49 13.21,16 v22.1,24.89
N$22  (via drill 0.61)
  Top 0.254: v14.99,6.35 12.95,6.35 RD-1.2 | v25.91,24.89 23.62,24.89 IC3.3
  Bottom 0.254: v14.99,6.35 19.05,10.41 19.05,11.18 20.32,12.45 23.62,12.45 25.91,14.73 v25.91,24.89
N$23  (via drill 0.61)
  Top 0.254: v11.94,42.16 11.94,43.94 U$6.O | v14.22,45.72 14.22,47.75 U$7.I
  Bottom 0.254: v11.94,42.16 11.94,43.43 v14.22,45.72
N$24  (via drill 0.61)
  Top 0.254: v16,44.2 17.27,44.2 U$7.O | v16,46.48 18.29,46.48 19.56,47.75 U$8.I
  Bottom 0.254: v16,46.48 v16,44.2
N$25  (via drill 0.61)
  Top 0.254: v23.11,46.23 23.11,44.2 U$8.O | v36.58,50.29 38.35,48.51 38.35,48.01 U$9.I
  Bottom 0.254: v23.11,46.23 23.11,48.51 26.92,52.32 34.54,52.32 v36.58,50.29
N$26
  Top 0.254: U$9.O 41.91,44.2 41.91,45.72 43.94,47.75 U$10.I
N$28  (via drill 0.61)
  Top 0.254: v47.5,42.16 47.5,43.94 U$10.O | v49.02,46.23 49.02,47.24 49.53,47.75 U$11.I
  Bottom 0.254: v47.5,42.16 47.5,44.7 v49.02,46.23
RESET  (via drill 0.61)
  Top 0.254: v21.08,31.5 21.08,32.77 IC3.13 | v22.86,33.27 26.67,33.27 28.45,31.5 28.45,30.99 32.26,27.18 v34.29,27.18 | v44.45,24.64 46.48,24.64 49.02,27.18 | 49.02,27.18 52.83,30.99 52.83,33.78 BTN1.B' 53.09,34.04 53.09,40.64 BTN1.B | ISP.5 50.29,16.76 49.02,18.03 49.02,27.18
  Bottom 0.254: v22.86,33.27 v21.08,31.5 | v34.29,27.18 36.83,24.64 v44.45,24.64
RXD  (via drill 0.61)
  Top 0.254: v3.81,31.24 4.32,31.24 7.11,34.04 7.11,36.58 9.4,38.86 15.24,38.86 16.51,37.59 16.51,35.56 15.49,34.54 15.49,33.02 IC3.20 | v16,8.64 25.15,8.64 27.69,6.1 JP2.3
  Bottom 0.254: v3.81,31.24 5.59,29.46 6.1,29.46 7.37,28.19 7.37,13.97 9.4,11.94 9.4,8.64 10.92,7.11 14.48,7.11 v16,8.64
SCK  (via drill 0.61)
  Top 0.254: v26.42,32.26 23.11,32.26 22.35,31.5 22.35,29.97 22.61,29.72 23.37,29.72 IC3.9 | v28.96,32.26 28.96,31.24 32,28.19 35.31,28.19 v35.56,28.45
  Bottom 0.254: v28.96,32.26 v26.42,32.26 | v35.56,28.45 38.61,28.45 41.4,25.65 44.7,25.65 49.02,21.34 49.02,19.81 50.29,18.54 ISP.3
SCL  (via drill 0.61)
  Top 0.254: v18.29,35.56 17.02,34.29 17.02,33.02 IC3.18 | v21.84,37.08 23.62,37.08 RIR3.1 | v36.58,47.75 LUXRGB1.2 | v27.94,50.29 27.94,48.77 27.43,48.26 LUXNIR.CLK | v36.83,23.62 36.83,25.65 38.86,27.69 v38.86,30.23 | v45.21,37.08 45.21,35.81 44.96,35.56 v44.96,32.26 | v28.19,37.08 30.48,37.08 30.73,37.34 IRL.1
  Bottom 0.254: LUXRGB2.2 30.48,44.2 30.23,43.94 30.23,43.43 29.72,42.93 28.19,42.93 | 28.19,42.93 27.94,42.93 27.43,43.43 LUXNIR1.CLK 27.18,43.43 25.65,43.43 20.57,38.35 | v18.29,35.56 18.29,36.07 20.57,38.35 | 20.57,38.35 v21.84,37.08 | v27.94,50.29 32.77,50.29 35.31,47.75 v36.58,47.75 36.58,41.66 41.15,37.08 v45.21,37.08 | JP2.6 35.31,10.41 33.78,11.94 33.78,17.27 36.83,20.32 v36.83,23.62 | v38.86,30.23 38.86,32.26 37.85,33.27 | 37.85,33.27 33.78,37.34 IRL.1 | v44.96,32.26 41.15,32.26 40.13,33.27 37.85,33.27 | v28.19,37.08 28.19,42.93
SDA  (via drill 0.61)
  Top 0.254: v25.65,46.99 27.18,46.99 LUXNIR.DATA | v17.53,36.58 17.27,36.32 17.27,35.56 16.26,34.54 16.26,33.02 IC3.19 | 33.78,44.45 v34.54,43.69 37.85,40.39 40.39,40.39 41.15,39.62 41.15,39.12 39.88,37.85 RIR4.1 39.62,37.59 36.07,37.59 33.27,34.8 IRA.1 | 33.78,44.45 31.5,46.74 31.5,47.24 LUXRGB1.6 | 33.78,44.45 v25.91,44.45
  Bottom 0.254: v25.65,46.99 25.65,46.48 26.42,45.72 | 26.42,45.72 27.18,44.96 LUXNIR1.DATA | 25.65,44.7 26.42,45.47 26.42,45.72 | 25.65,44.7 v17.53,36.58 | v34.54,43.69 33.02,43.69 LUXRGB2.6 | JP2.5 32.77,28.7 32,29.46 32,33.78 33.02,34.8 IRA.1 | v25.91,44.45 25.65,44.7
TXD  (via drill 0.61)
  Top 0.254: v13.72,34.54 14.48,33.78 14.48,33.02 IC3.21 | v10.92,34.54 10.92,33.02 8.38,30.48 v8.38,26.67 | v17.02,9.65 23.37,9.65 23.88,9.14 26.92,9.14 30.23,5.84 JP2.4
  Bottom 0.254: v10.92,34.54 v13.72,34.54 | v8.38,26.67 8.38,25.15 8.13,24.89 8.13,13.97 9.91,12.19 9.91,8.89 11.18,7.62 13.72,7.62 15.75,9.65 v17.02,9.65
VBAT  (via drill 0.61)
  Top 0.254: BAT1.P$2 46.99,7.87 40.13,7.87 37.08,10.92 37.08,11.94 36.07,12.95 36.07,13.97 IC2.3 35.81,14.22 34.8,14.22 34.54,14.48 29.97,14.48 29.46,13.97 26.67,13.97 v24.89,15.75 | 10.92,50.55 11.94,50.55 J1.2 | 10.92,50.55 9.65,51.82 9.4,51.82 8.64,52.58 8.64,53.85 9.91,55.12 11.18,55.12 11.94,55.88 J1.5 | 10.92,50.55 10.92,50.29 v10.67,50.04 | v8.13,49.78 7.11,48.77 7.11,44.2 v3.81,40.89 | 6.86,22.86 7.37,22.35 CN1.1 | 6.86,22.86 v6.1,23.62 | v9.65,18.8 5.59,18.8 4.83,19.56 4.83,20.83 6.86,22.86
  Bottom 0.254: v10.67,50.04 8.38,50.04 v8.13,49.78 | v3.81,40.89 2.79,40.89 1.52,39.62 1.52,28.19 v6.1,23.62 | v24.89,15.75 24.89,17.27 25.15,17.53 25.15,23.88 22.61,26.42 20.32,26.42 18.54,24.64 16.26,24.64 14.48,22.86 12.7,22.86 10.41,25.15 9.91,25.15 9.14,24.38 9.14,19.3 v9.65,18.8
VBUS  (via drill 0.61)
  Top 0.254: v42.42,20.32 36.32,20.32 C1.1 | 29.72,13.46 30.48,13.46 30.99,13.97 34.29,13.97 35.81,12.45 35.81,11.68 IC2.4 35.81,11.43 37.85,9.4 v37.85,8.89 | 29.72,13.46 26.42,13.46 26.16,13.72 v23.62,13.72 22.61,13.72 RN1.5 | v27.43,28.19 27.18,27.94 23.62,27.94 IC3.7 | 29.72,13.46 v29.72,12.95 | v11.68,12.95 10.67,12.95 9.91,12.19 8.89,12.19 X2.VBUS
  Bottom 0.254: ISP.2 47.75,20.83 47.24,20.32 v42.42,20.32 42.42,13.46 v37.85,8.89 | v27.43,28.19 27.43,15.24 v29.72,12.95 | v11.68,12.95 22.86,12.95 v23.62,13.72
VCC  (via drill 0.61)
  Top 0.254: 19.05,30.99 20.07,32 20.07,32.77 IC3.14 | 19.05,30.99 18.54,30.48 12.19,30.48 IC3.24 11.94,30.48 11.18,30.48 10.67,30.99 10.67,32 11.94,33.27 11.94,36.32 v11.68,36.58 | IC3.6 22.86,27.18 22.35,27.69 | 19.05,30.99 22.35,27.69 | RU1.2 22.1,6.6 22.61,6.1 | 19.56,20.07 17.78,20.07 | 17.78,20.07 14.22,20.07 13.97,20.32 13.97,21.34 IC3.34 | 19.56,20.07 20.07,20.57 20.07,21.34 IC3.42 20.32,21.59 20.32,25.65 22.35,27.69 | 17.78,20.07 C3.1 17.78,12.7 19.56,12.7 22.1,10.16 27.18,10.16 | 19.56,20.07 21.34,20.07 21.59,20.32 21.59,21.34 IC3.44 | 27.18,10.16 28.45,11.43 32.77,11.43 U$1.+ | 22.61,6.1 23.62,6.1 v24.89,7.37 | 27.18,10.16 v27.43,9.91 | 22.61,6.1 JP2.1 | C4.1 45.47,54.1 48.51,54.1 50.8,51.82 THM1.2 | T1.2 43.94,33.27 42.93,33.27 41.4,34.8 41.4,35.31 43.43,37.34 43.94,37.34 T2.2 43.94,37.59 44.96,38.61 44.96,39.88 44.2,40.64 44.2,43.94 U$10.D 44.2,44.2 44.2,44.96 45.21,45.97 47.75,45.97 49.02,44.7 | 49.02,44.7 49.53,44.2 U$11.D | 49.02,44.7 v50.8,46.48 | v36.32,26.42 35.56,25.65 35.56,23.37 IC4.2 | 32.77,29.97 30.48,32.26 IRP.1 30.73,32.26 30.73,34.54 34.04,37.85 34.04,38.86 32.51,40.39 28.7,40.39 26.92,38.61 24.13,38.61 23.88,38.86 RIR3.2 23.62,39.12 23.62,40.13 | 32.77,29.97 38.61,35.81 39.62,35.81 RIR4.2 | 32.77,29.97 v33.02,29.72 | 33.53,47.24 35.31,47.24 38.35,44.2 U$9.D 38.35,43.94 v39.88,42.42 | 33.53,47.24 33.27,47.24 LUXRGB1.1 33.53,47.24 | 28.96,46.99 v27.94,45.97 | 28.96,46.99 28.96,47.5 LUXNIR.ADR | 28.96,46.99 LUXNIR.VDD | v30.48,45.97 30.48,48.51 30.99,49.02 30.99,50.29 C14.1 | v33.53,45.97 33.53,47.24 | U$6.D 8.64,44.2 8.64,44.96 9.65,45.97 12.19,45.97 13.97,44.2 U$7.D 14.22,43.94 14.99,43.94 16.51,42.42 17.27,42.42
  Top 0.254: 21.34,42.42 19.81,43.94 U$8.D | 21.34,42.42 23.62,40.13 | 21.34,42.42 17.27,42.42 | v31.75,42.93 26.42,42.93 23.62,40.13 | 17.27,42.42 v17.27,42.16
  Bottom 0.254: v27.43,9.91 v24.89,7.37 | THM1.2 v50.8,46.48 50.8,44.2 47.75,41.15 41.15,41.15 v39.88,42.42 | v33.02,29.72 v36.32,26.42 | 30.99,42.67 30.99,41.4 C5.1 | 30.99,42.67 30.99,43.69 LUXRGB2.1 | LUXNIR1.VDD 28.96,44.96 v27.94,45.97 28.96,46.99 29.46,46.99 v30.48,45.97 v33.53,45.97 35.56,43.94 35.56,43.43 34.8,42.67 31.75,42.67 | 31.75,42.67 30.99,42.67 | v31.75,42.93 31.75,42.67 | v17.27,42.16 v11.68,36.58
VDD  (via drill 0.61)
  Top 0.254: J1.4 14.48,55.88 15.24,55.12 15.24,52.58 14.48,51.82 14.48,50.55 J1.1 14.48,50.29 14.48,49.78 14.99,49.28 14.99,46.23 15.75,45.47 v18.54,45.47 | 34.54,26.16 IC4.3 | 34.54,26.16 37.34,28.96 C2.1 | v7.37,41.15 v10.92,41.15 | 34.54,26.16 v31.24,26.16
  Bottom 0.254: v18.54,45.47 14.22,41.15 v10.92,41.15 | v7.37,41.15 7.37,39.88 7.87,39.37 7.87,29.46 9.91,27.43 19.81,27.43 23.62,31.24 26.16,31.24 v31.24,26.16

### Text on the board
tPlace: ***OPEN-LUX*** REV-D | REV-D | LUX | RGB | + | - | JST | USB
bPlace: NOKIA 5110 | publiclab.org/wiki/open-lux | A1 | RGB | LUX | GND | RESET | MOSI | SCK | MISO | VBUS